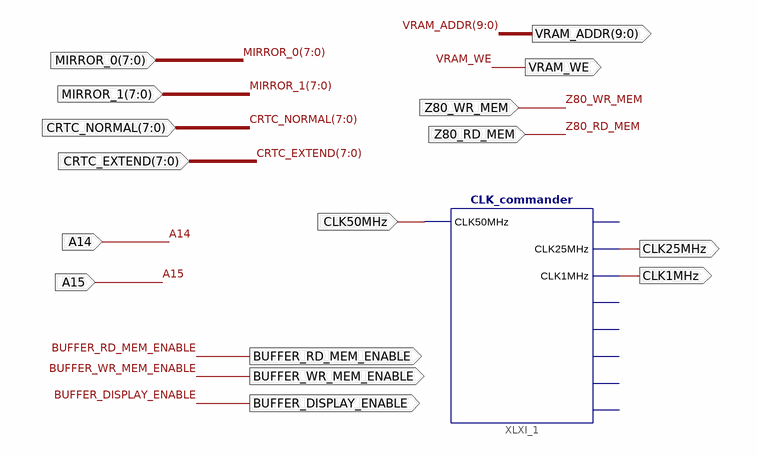
[diagram p0: schematic sheet 1]
// Xilinx ISE schematic BarbarianSequencer.sch (spartan3) as structural Verilog: 1 symbols, 16 ports
module BarbarianSequencer (
  input  [7:0] CRTC_NORMAL,
  input  CLK50MHz,
  input  [7:0] MIRROR_1,
  input  [7:0] MIRROR_0,
  input  [7:0] CRTC_EXTEND,
  input  Z80_WR_MEM,
  input  Z80_RD_MEM,
  input  A14,
  input  A15,
  output CLK1MHz,
  output CLK25MHz,
  output VRAM_WE,
  output [9:0] VRAM_ADDR,
  output BUFFER_DISPLAY_ENABLE,
  output BUFFER_WR_MEM_ENABLE,
  output BUFFER_RD_MEM_ENABLE
);

  CLK_commander XLXI_1 (
    .CLK50MHz(CLK50MHz), .CLK25MHz(CLK25MHz), .CLK1MHz(CLK1MHz));  // open: CLK100MHz, PREPARE_WRITE, DO_WRITE, PREPARE_READ, DO_READ, CLK4MHz
endmodule
